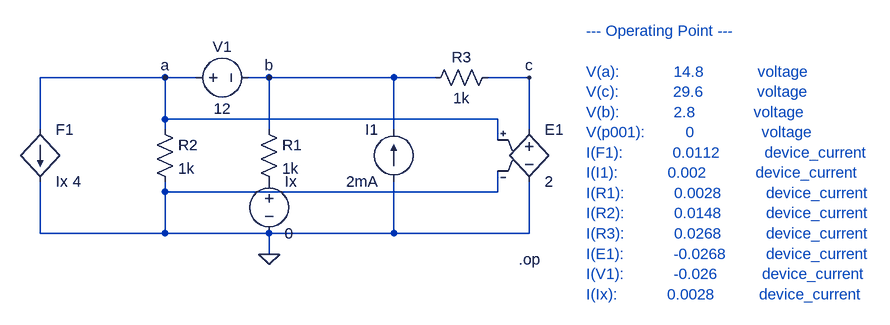
[diagram p0: schematic Q4LT.asc]
Q4LT.asc, the LTspice schematic file:
Version 4
SHEET 1 1268 680
WIRE 144 48 -48 48
WIRE 192 48 144 48
WIRE 304 48 272 48
WIRE 496 48 304 48
WIRE 560 48 496 48
WIRE 704 48 640 48
WIRE 144 112 144 48
WIRE 656 112 144 112
WIRE -48 128 -48 48
WIRE 144 128 144 112
WIRE 304 128 304 48
WIRE 496 128 496 48
WIRE 704 128 704 48
WIRE 656 144 656 112
WIRE 144 224 144 208
WIRE 656 224 656 192
WIRE 656 224 144 224
WIRE -48 288 -48 208
WIRE 144 288 144 224
WIRE 144 288 -48 288
WIRE 304 288 144 288
WIRE 496 288 496 208
WIRE 496 288 304 288
WIRE 704 288 704 208
WIRE 704 288 496 288
WIRE 304 320 304 288
FLAG 304 320 0
FLAG 144 48 a
FLAG 304 48 b
FLAG 704 48 c
SYMBOL f -48 128 R0
SYMATTR InstName F1
SYMATTR Value Ix 4
SYMBOL e 704 112 R0
SYMATTR InstName E1
SYMATTR Value 2
SYMBOL current 496 208 R180
WINDOW 0 24 80 Left 2
WINDOW 3 24 0 Left 2
SYMATTR InstName I1
SYMATTR Value 2mA
SYMBOL res 288 112 R0
SYMATTR InstName R1
SYMATTR Value 1k
SYMBOL res 128 112 R0
SYMATTR InstName R2
SYMATTR Value 1k
SYMBOL res 656 32 R90
WINDOW 0 0 56 VBottom 2
WINDOW 3 32 56 VTop 2
SYMATTR InstName R3
SYMATTR Value 1k
SYMBOL voltage 176 48 R270
WINDOW 0 32 56 VTop 2
WINDOW 3 -32 56 VBottom 2
SYMATTR InstName V1
SYMATTR Value 12
SYMBOL voltage 304 192 R0
SYMATTR InstName Ix
SYMATTR Value 0
TEXT 688 328 Left 2 !.op
TEXT 792 -24 Left 2 ;--- Operating Point ---\n \nV(a):            14.8            voltage\nV(c):            29.6            voltage\nV(b):            2.8             voltage\nV(p001):         0               voltage\nI(F1):           0.0112          device_current\nI(I1):           0.002           device_current\nI(R1):           0.0028          device_current\nI(R2):           0.0148          device_current\nI(R3):           0.0268          device_current\nI(E1):           -0.0268         device_current\nI(V1):           -0.026          device_current\nI(Ix):           0.0028          device_current

The netlist it stands for:
* Q4LT.asc
F1 a 0 Ix 4
E1 c 0 a 0 2
I1 0 b 2mA
R1 b P001 1k
R2 a 0 1k
R3 c b 1k
V1 a b 12
V§Ix P001 0 0
.op
* --- Operating Point ---
* V(a):            14.8            voltage
* V(c):            29.6            voltage
* V(b):            2.8             voltage
* V(p001):         0               voltage
* I(F1):           0.0112          device_current
* I(I1):           0.002           device_current
* I(R1):           0.0028          device_current
* I(R2):           0.0148          device_current
* I(R3):           0.0268          device_current
* I(E1):           -0.0268         device_current
* I(V1):           -0.026          device_current
* I(Ix):           0.0028          device_current
.backanno
.end